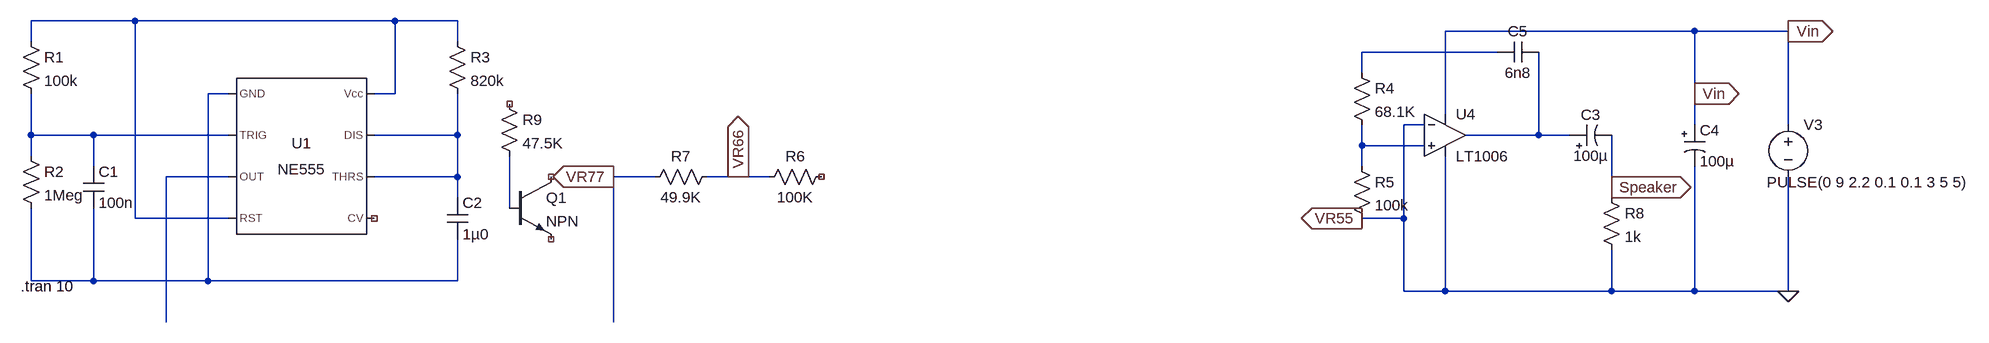
[diagram p0: schematic Full_circuit.asc]
Full_circuit.asc, the LTspice schematic file:
Version 4
SHEET 1 2284 680
WIRE -736 -64 -896 -64
WIRE -336 -64 -736 -64
WIRE -240 -64 -336 -64
WIRE 1664 -48 1280 -48
WIRE 1808 -48 1664 -48
WIRE -896 -32 -896 -64
WIRE -240 -32 -240 -64
WIRE 1360 -16 1152 -16
WIRE 1152 16 1152 -16
WIRE -592 48 -624 48
WIRE -336 48 -336 -64
WIRE -336 48 -368 48
WIRE 1664 48 1664 -48
WIRE 1280 80 1280 -48
WIRE 1248 96 1216 96
WIRE 1664 96 1664 48
WIRE 1808 96 1808 -48
WIRE -896 112 -896 48
WIRE -800 112 -896 112
WIRE -592 112 -800 112
WIRE -240 112 -240 48
WIRE -240 112 -368 112
WIRE 1424 112 1424 -16
WIRE 1424 112 1312 112
WIRE 1472 112 1424 112
WIRE 1152 128 1152 96
WIRE 1248 128 1152 128
WIRE -896 144 -896 112
WIRE -800 160 -800 112
WIRE 1152 160 1152 128
WIRE -592 176 -688 176
WIRE -240 176 -240 112
WIRE -240 176 -368 176
WIRE 64 176 0 176
WIRE 192 176 144 176
WIRE 240 176 192 176
WIRE 1536 192 1536 112
WIRE -240 208 -240 176
WIRE 1536 208 1536 192
WIRE -160 224 -160 144
WIRE -736 240 -736 -64
WIRE -592 240 -736 240
WIRE 1216 240 1216 96
WIRE 1216 240 1152 240
WIRE -896 336 -896 224
WIRE -800 336 -800 224
WIRE -800 336 -896 336
WIRE -624 336 -624 48
WIRE -624 336 -800 336
WIRE -240 336 -240 272
WIRE -240 336 -624 336
WIRE 1216 352 1216 240
WIRE 1280 352 1280 144
WIRE 1280 352 1216 352
WIRE 1536 352 1536 288
WIRE 1536 352 1280 352
WIRE 1664 352 1664 160
WIRE 1664 352 1536 352
WIRE 1808 352 1808 176
WIRE 1808 352 1664 352
WIRE -688 400 -688 176
WIRE 0 400 0 176
FLAG 1808 -48 Vin
IOPIN 1808 -48 Out
FLAG 1808 352 0
FLAG 1536 192 Speaker
IOPIN 1536 192 Out
FLAG 1152 240 VR55
IOPIN 1152 240 Out
FLAG 0 176 VR77
IOPIN 0 176 Out
FLAG 192 176 VR66
IOPIN 192 176 Out
FLAG 1664 48 Vin
IOPIN 1664 48 Out
SYMBOL Misc\\NE555 -480 144 R0
SYMATTR InstName U1
SYMBOL res -912 -48 R0
SYMATTR InstName R1
SYMATTR Value 100k
SYMBOL res -912 128 R0
SYMATTR InstName R2
SYMATTR Value 1Meg
SYMBOL cap -816 160 R0
SYMATTR InstName C1
SYMATTR Value 100n
SYMBOL res -256 -48 R0
SYMATTR InstName R3
SYMATTR Value 820k
SYMBOL cap -256 208 R0
SYMATTR InstName C2
SYMATTR Value 1µ0
SYMBOL polcap 1472 128 R270
WINDOW 0 32 32 VTop 2
WINDOW 3 0 32 VBottom 2
SYMATTR InstName C3
SYMATTR Value 100µ
SYMATTR Description Capacitor
SYMATTR Type cap
SYMATTR SpiceLine V=10 Irms=0 Rser=0.1 Lser=0 mfg="AVX" pn="TPSD107M010R0100" type="Tantalum"
SYMBOL polcap 1648 96 R0
SYMATTR InstName C4
SYMATTR Value 100µ
SYMATTR Description Capacitor
SYMATTR Type cap
SYMATTR SpiceLine V=10 Irms=0 Rser=0.1 Lser=0
SYMBOL cap 1360 0 R270
WINDOW 0 32 32 VTop 2
WINDOW 3 0 32 VBottom 2
SYMATTR InstName C5
SYMATTR Value 6n8
SYMATTR SpiceLine V=6.3 Irms=173m Rser=1.00156 Lser=0
SYMBOL res 1136 0 R0
SYMATTR InstName R4
SYMATTR Value 68.1K
SYMATTR SpiceLine tol=1 pwr=0.1
SYMBOL res 1136 144 R0
SYMATTR InstName R5
SYMATTR Value 100k
SYMATTR SpiceLine tol=1 pwr=0.1
SYMBOL res 336 160 R90
WINDOW 0 0 56 VBottom 2
WINDOW 3 32 56 VTop 2
SYMATTR InstName R6
SYMATTR Value 100K
SYMATTR SpiceLine tol=1 pwr=0.1
SYMBOL npn -160 176 R0
SYMATTR InstName Q1
SYMBOL res 160 160 R90
WINDOW 0 0 56 VBottom 2
WINDOW 3 32 56 VTop 2
SYMATTR InstName R7
SYMATTR Value 49.9K
SYMATTR SpiceLine tol=1 pwr=0.1
SYMBOL res 1520 192 R0
SYMATTR InstName R8
SYMATTR Value 1k
SYMATTR SpiceLine tol=1 pwr=0.1
SYMBOL res -176 48 R0
SYMATTR InstName R9
SYMATTR Value 47.5K
SYMATTR SpiceLine tol=1 pwr=0.1
SYMBOL OpAmps\\LT1006 1280 48 R0
SYMATTR InstName U4
SYMBOL voltage 1808 80 R0
WINDOW 123 0 0 Left 0
WINDOW 39 0 0 Left 0
WINDOW 3 -33 104 Left 2
SYMATTR Value PULSE(0 9 2.2 0.1 0.1 3 5 5)
SYMATTR InstName V3
TEXT -912 344 Left 2 !.tran 10

The netlist it stands for:
* Full_circuit.asc
XU1 N003 N004 N008 N001 NC_01 N005 N005 N001 NE555  ; pins GND TRIG OUT RST CV THRS DIS Vcc
R1 N001 N004 100k
R2 N004 N003 1Meg
C1 N004 N003 100n
R3 N001 N005 820k
C2 N005 N003 1µ0
C3 N006 Speaker 100µ V=10 Irms=0 Rser=0.1 Lser=0 mfg="AVX" pn="TPSD107M010R0100" type="Tantalum"
C4 Vin 0 100µ V=10 Irms=0 Rser=0.1 Lser=0
C5 N002 N006 6n8 V=6.3 Irms=173m Rser=1.00156 Lser=0
R4 N002 N007 68.1K tol=1 pwr=0.1
R5 N007 0 100k tol=1 pwr=0.1
R6 NC_02 VR66 100K tol=1 pwr=0.1
Q1 NC_03 N009 NC_04 0 NPN
R7 VR66 VR77 49.9K tol=1 pwr=0.1
R8 Speaker 0 1k tol=1 pwr=0.1
R9 NC_05 N009 47.5K tol=1 pwr=0.1
XU4 N007 0 Vin 0 N006 LT1006  ; pins In+ In- V+ V- OUT
V3 Vin 0 PULSE(0 9 2.2 0.1 0.1 3 5 5)
.model NPN NPN
.model PNP PNP
.lib standard.bjt
.tran 10
.lib NE555.sub
.lib LTC.lib
.backanno
.end